# Altium schematic sheet POWER.SchDoc: LED Cube 8x8x8 - POWER
size A4; Author: Luka Penger; CompanyName: L. Penger; DrawnBy: Luka Penger; Organization: L. Penger; Address1: Luka Penger; Address2: http://lukapenger.eu; Address3: Software & Hardware; Address4: Development; DocumentNumber: 2; Revision: 1.0.0; SheetNumber: 2; SheetTotal: 4; DocumentName: POWER; ProjectName: LED Cube 8x8x8
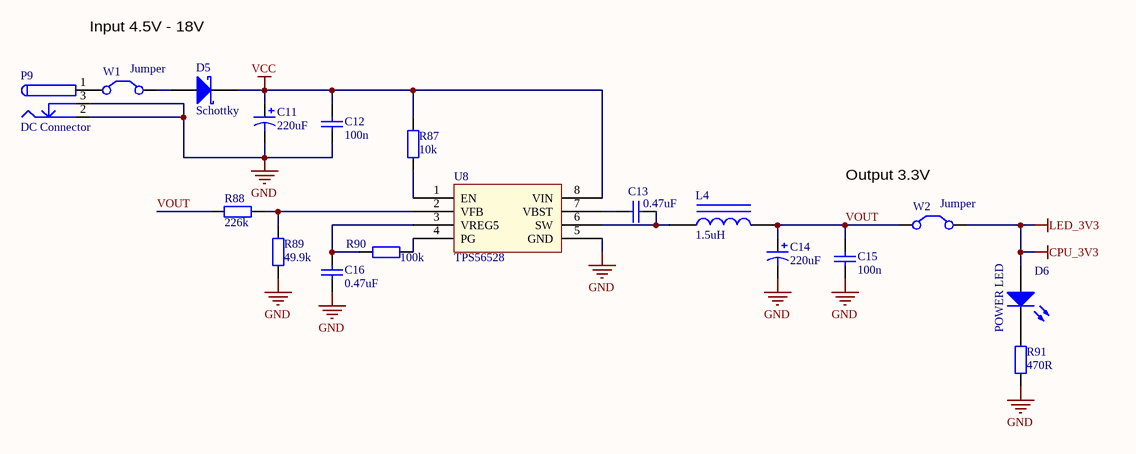
[diagram p0: POWER.SchDoc]

## Parts
C11  220uF  [SMD CAPACITOR 220uF]
C12  100n  [1608[0603]]
C13  0.47uF  [1608[0603]]
C14  220uF  [SMD CAPACITOR 220uF]
C15  100n  [1608[0603]]
C16  0.47uF  [1608[0603]]
D5  Schottky  [SMB]
D6  POWER LED  [LED-1]
L4  1.5uH  [Inductor]
P9  DC Connector  [DC Connector]
R87  10k  [1608[0603]]
R88  226k  [1608[0603]]
R89  49.9k  [1608[0603]]
R90  100k  [1608[0603]]
R91  470R  [1608[0603]]
U8  TPS56528  [TPS56528]
W1  Jumper  [HDR1X2]
W2  Jumper  [HDR1X2]

## Nets
CPU_3V3: D6.1(A) W2.2(C2)  [also labelled LED_3V3]
GND: C11.2 C12.2 C14.2 C15.2 C16.2 P9.2 P9.3 R89.1 R91.1 U8.5(GND)
VCC: C11.1 C12.1 D5.2(K) R87.2 U8.8(VIN)
VOUT: C14.1 C15.1 L4.2 R88.2 W2.1(C1)
NetC13_1: C13.1 U8.7(VBST)
NetC13_2: C13.2 L4.1 U8.6(SW)
NetC16_1: C16.1 R90.2 U8.3(VREG5)
NetD5_1: D5.1(A) W1.2(C2)
NetD6_2: D6.2(K) R91.2
NetP9_1: P9.1 W1.1(C1)
NetR87_1: R87.1 U8.1(EN)
NetR88_1: R88.1 R89.2 U8.2(VFB)
NetR90_1: R90.1 U8.4(PG)

## Notes on the sheet
- Input 4.5V - 18V
- (near W2) Output 3.3V
- Title
- Size:
- Date:
- A4
- Number:
- Time:
- Revision:
- Sheet
- of
- File:

## Library data of the parts
C11 C14 = Cap Pol1: Capacitor; Value: 100pF; Published: 8-Jun-2000; LatestRevisionDate: 17-Jul-2002; LatestRevisionNote: Re-released for DXP Platform.; PackageReference: RB7.6-15; Publisher: Altium Limited; PackageDescription: Polarized Capacitor (Radial); 2 Leads
C12 C13 C15 C16 = Cap: Capacitor; Value: 100pF; Published: 8-Jun-2000; LatestRevisionDate: 17-Jul-2002; LatestRevisionNote: Re-released for DXP Platform.; PackageReference: RAD-0.3; Publisher: Altium Limited; PackageDescription: Radial Cap, Thru-Hole; 2 Leads; 0.3 in Pin Spacing
D5 = D Schottky: Schottky Diode; Published: 8-Jun-2000; LatestRevisionDate: 17-Jul-2002; LatestRevisionNote: Re-released for DXP Platform.; PackageReference: SMB; Publisher: Altium Limited; PackageDescription: DO-214-AA/SMB; 2 C-Bend Leads; Body 5.3 x 3.6 mm, inc. leads (LxW); Code_JEDEC: DO-214-AA
D6 = LED0: Typical INFRARED GaAs LED; Published: 8-Jun-2000; LatestRevisionDate: 08-Jul-2005; LatestRevisionNote: Mech Layer 1 removed.; PackageReference: LED-0; Publisher: Altium Limited; PackageDescription: LED; 2 Leads
L4 = Inductor Iron: Magnetic-Core Inductor; Value: 10mH; Published: 24-Mar-1999; LatestRevisionDate: 17-Jul-2002; LatestRevisionNote: Re-released for DXP Platform.; PackageReference: AXIAL-0.9; Publisher: Altium Limited; PackageDescription: Axial Device, Thru-Hole; 2 Leads; 0.9 in Pin Spacing
P9 = DC Connector: DC Power Connector
R87-R91 = Res2: Resistor; Value: 1K; Published: 8-Jun-2000; LatestRevisionDate: 17-Jul-2002; LatestRevisionNote: Re-released for DXP Platform.; PackageReference: AXIAL-0.4; Publisher: Altium Limited; PackageDescription: Axial Device, Thru-Hole; 2 Leads; 0.4 in Pin Spacing
U8 = TPS56528: Step-Down Converter 5A 4.5V-18V
W1 W2 = Jumper: Jumper Wire; Published: 24-Mar-1999; LatestRevisionDate: 17-Jul-2002; LatestRevisionNote: Re-released for DXP Platform.; PackageReference: RAD-0.2; Publisher: Altium Limited; PackageDescription: Radial Cap, Thru-Hole; 2 Leads; 0.2 in Pin Spacing